# Altium schematic sheet Sheet1.SchDoc
size A2
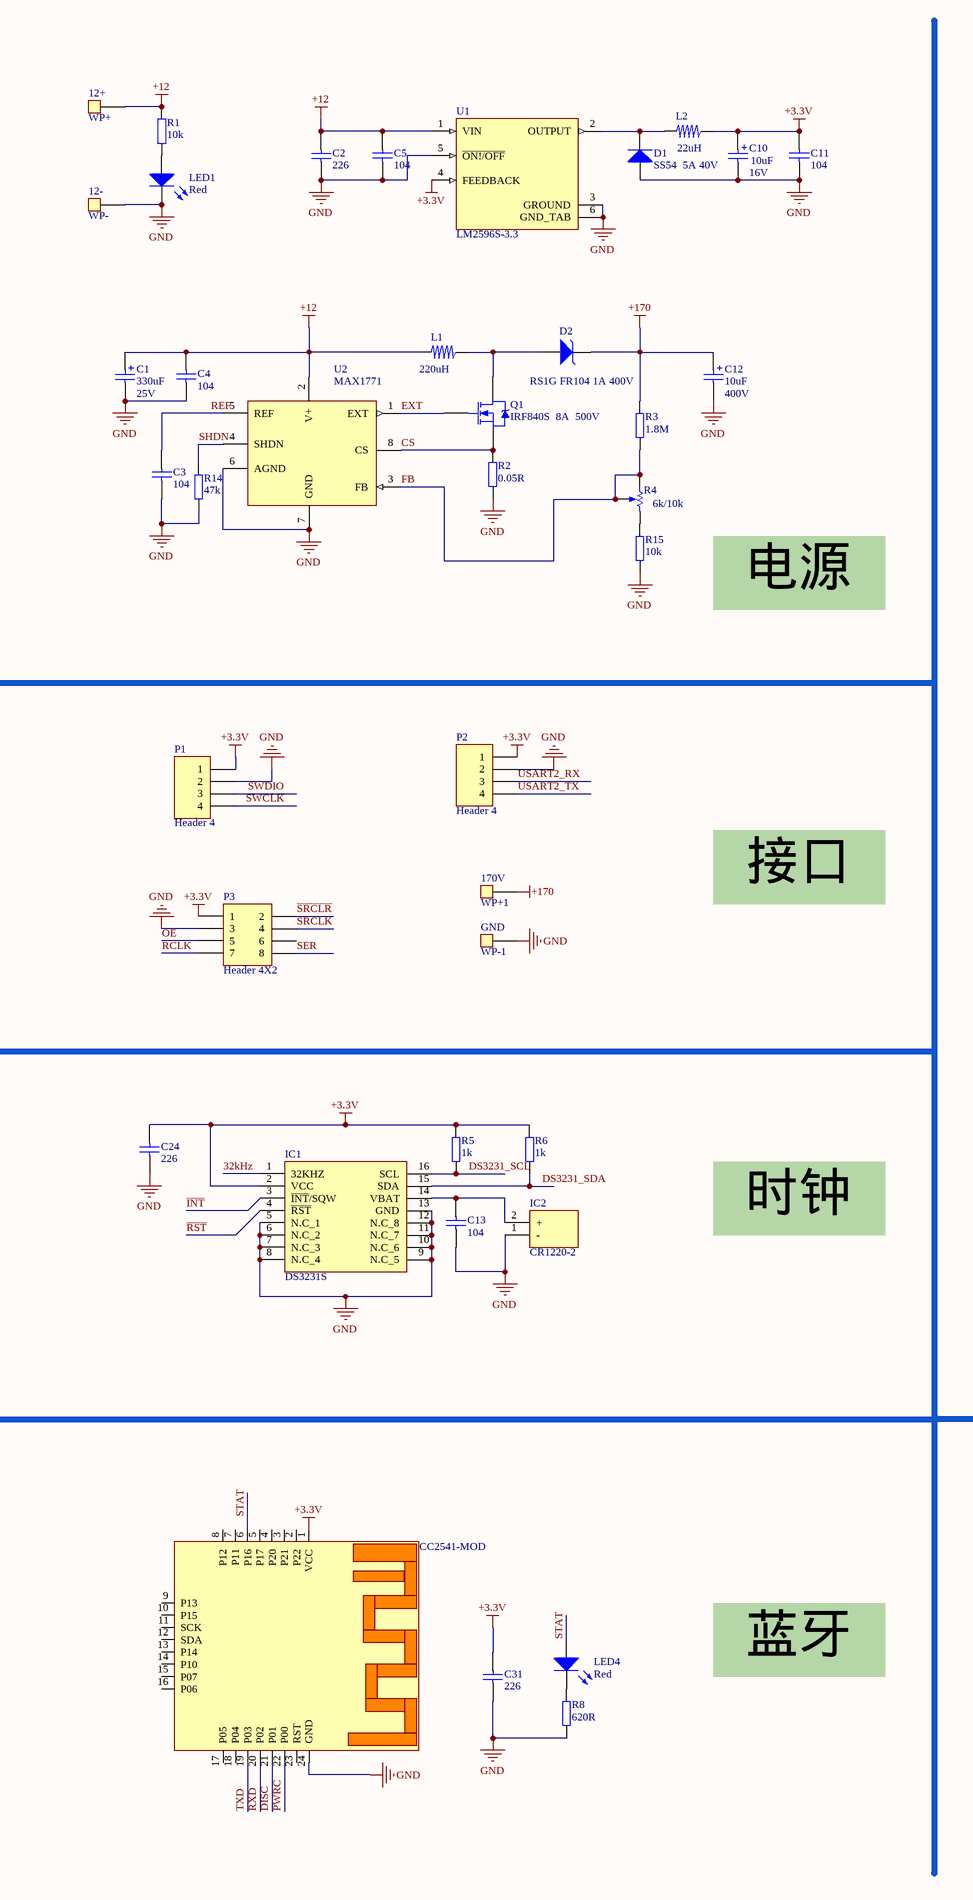
[diagram p0: Sheet1.SchDoc, left]
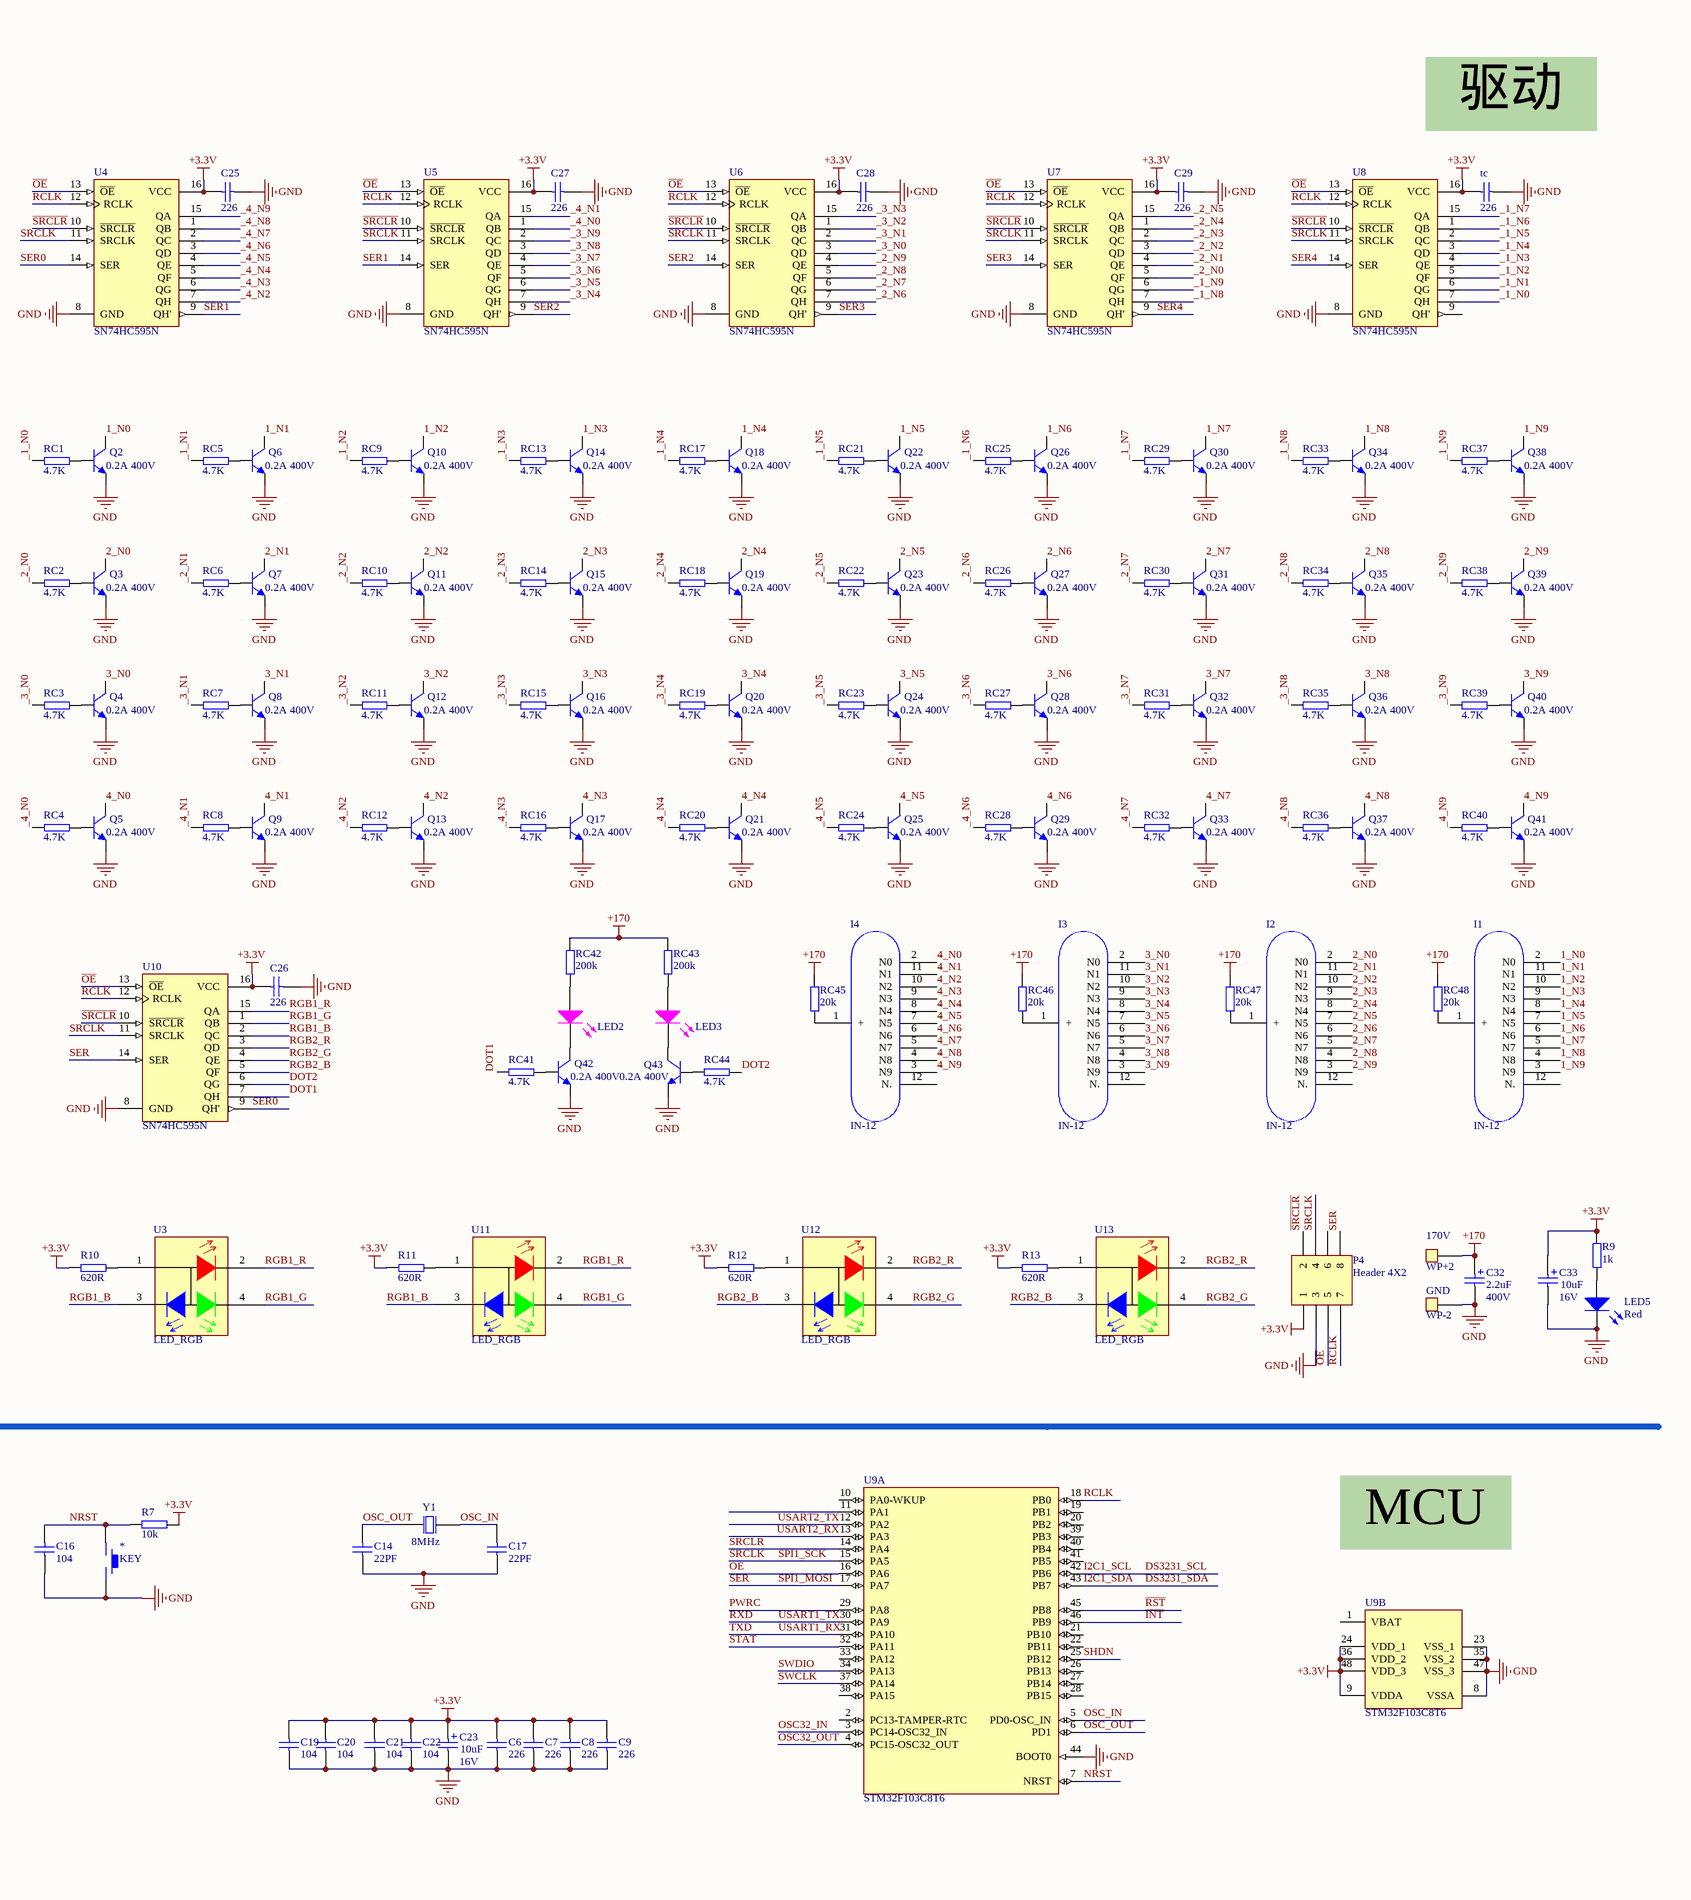
[diagram p1: Sheet1.SchDoc, right]

## Parts
*  KEY  [KEY]
?  CC2541-MOD  [JDY-08]
C1  Voltage: 25V  [CAPS8]  (hidden comment: 330uF)
C2  226  [CAPC1608[0603]]
C3  104  [CAPC1608[0603]]
C4  104  [CAPC1608[0603]]
C5  104  [CAPC1608[0603]]
C6  226  [CAPC1608[0603]]
C7  226  [CAPC1608[0603]]
C8  226  [CAPC1608[0603]]
C9  226  [CAPC1608[0603]]
C10  Voltage: 16V  [CAPS4]  (hidden comment: 10uF)
C11  104  [CAPC1608[0603]]
C12  Voltage: 400V  [CAPS10]  (hidden comment: 10uF)
C13  104  [CAPC1608[0603]]
C14  22PF  [CAPC1608[0603]]
C16  104  [CAPC1608[0603]]
C17  22PF  [CAPC1608[0603]]
C19  104  [CAPC1608[0603]]
C20  104  [CAPC1608[0603]]
C21  104  [CAPC1608[0603]]
C22  104  [CAPC1608[0603]]
C23  Voltage: 16V  [CAPS4]  (hidden comment: 10uF)
C24  226  [CAPC1608[0603]]
C25  226  [CAPC1608[0603]]
C26  226  [CAPC1608[0603]]
C27  226  [CAPC1608[0603]]
C28  226  [CAPC1608[0603]]
C29  226  [CAPC1608[0603]]
C31  226  [CAPC1608[0603]]
C32  Voltage: 400V  [CAPS6.3]  (hidden comment: 2.2uF)
C33  Voltage: 16V  [CAPS4]  (hidden comment: 10uF)
D1  SS54  5A 40V  [SMA[DO-214AC]]
D2  RS1G FR104 1A 400V  [SMA[DO-214AC]]
I1  IN-12  [Nixie_IN12-hole]
I2  IN-12  [Nixie_IN12-hole]
I3  IN-12  [Nixie_IN12-hole]
I4  IN-12  [Nixie_IN12-hole]
IC1  DS3231S  [SOIC127P1032X265-16N]
IC2  CR1220-2  [CR12202]
L1  220uH  [WHC1770]
L2  22uH  [WHC0630]
LED1  Red  [LEDC1608(0603)]
LED2  LED 5R  [LED-R5-H9-SINGLE-R]  (value not drawn)
LED3  LED 5R  [LED-R5-H9-SINGLE-R]  (value not drawn)
LED4  Red  [LEDC1608(0603)]
LED5  Red  [LEDC1608(0603)]
P1  Header 4  [HDR1X4]
P2  Header 4  [HDR1X4]
P3  Header 4X2  [HDR2X4]
P4  Header 4X2  [HDR2X4]
Q1  IRF840S  8A  500V  [TO-263]
Q2  0.2A 400V  [SOT23]
Q3  0.2A 400V  [SOT23]
Q4  0.2A 400V  [SOT23]
Q5  0.2A 400V  [SOT23]
Q6  0.2A 400V  [SOT23]
Q7  0.2A 400V  [SOT23]
Q8  0.2A 400V  [SOT23]
Q9  0.2A 400V  [SOT23]
Q10  0.2A 400V  [SOT23]
Q11  0.2A 400V  [SOT23]
Q12  0.2A 400V  [SOT23]
Q13  0.2A 400V  [SOT23]
Q14  0.2A 400V  [SOT23]
Q15  0.2A 400V  [SOT23]
Q16  0.2A 400V  [SOT23]
Q17  0.2A 400V  [SOT23]
Q18  0.2A 400V  [SOT23]
Q19  0.2A 400V  [SOT23]
Q20  0.2A 400V  [SOT23]
Q21  0.2A 400V  [SOT23]
Q22  0.2A 400V  [SOT23]
Q23  0.2A 400V  [SOT23]
Q24  0.2A 400V  [SOT23]
Q25  0.2A 400V  [SOT23]
Q26  0.2A 400V  [SOT23]
Q27  0.2A 400V  [SOT23]
Q28  0.2A 400V  [SOT23]
Q29  0.2A 400V  [SOT23]
Q30  0.2A 400V  [SOT23]
Q31  0.2A 400V  [SOT23]
Q32  0.2A 400V  [SOT23]
Q33  0.2A 400V  [SOT23]
Q34  0.2A 400V  [SOT23]
Q35  0.2A 400V  [SOT23]
Q36  0.2A 400V  [SOT23]
Q37  0.2A 400V  [SOT23]
Q38  0.2A 400V  [SOT23]
Q39  0.2A 400V  [SOT23]
Q40  0.2A 400V  [SOT23]
Q41  0.2A 400V  [SOT23]
Q42  0.2A 400V  [SOT23]
Q43  0.2A 400V  [SOT23]
R1  10k  [RESC1608[0603]]
R2  value 0.05R  [RESC3225[1210]]  (hidden comment: 0.05)
R3  1.8M  [RESC1608[0603]]
R4  6k/10k  [Rhostat3]
R5  1k  [RESC1608[0603]]
R6  1k  [RESC1608[0603]]
R7  10k  [RESC1608[0603]]
R8  620R  [RESC1608[0603]]
R9  1k  [RESC1608[0603]]
R10  620R  [RESC1608[0603]]
R11  620R  [RESC1608[0603]]
R12  620R  [RESC1608[0603]]
R13  620R  [RESC1608[0603]]
R14  47k  [RESC1608[0603]]
R15  10k  [RESC1608[0603]]
RC1  4.7K  [RESC1608[0603]]
RC2  4.7K  [RESC1608[0603]]
RC3  4.7K  [RESC1608[0603]]
RC4  4.7K  [RESC1608[0603]]
RC5  4.7K  [RESC1608[0603]]
RC6  4.7K  [RESC1608[0603]]
RC7  4.7K  [RESC1608[0603]]
RC8  4.7K  [RESC1608[0603]]
RC9  4.7K  [RESC1608[0603]]
RC10  4.7K  [RESC1608[0603]]
RC11  4.7K  [RESC1608[0603]]
RC12  4.7K  [RESC1608[0603]]
RC13  4.7K  [RESC1608[0603]]
RC14  4.7K  [RESC1608[0603]]
RC15  4.7K  [RESC1608[0603]]
RC16  4.7K  [RESC1608[0603]]
RC17  4.7K  [RESC1608[0603]]
RC18  4.7K  [RESC1608[0603]]
RC19  4.7K  [RESC1608[0603]]
RC20  4.7K  [RESC1608[0603]]
RC21  4.7K  [RESC1608[0603]]
RC22  4.7K  [RESC1608[0603]]
RC23  4.7K  [RESC1608[0603]]
RC24  4.7K  [RESC1608[0603]]
RC25  4.7K  [RESC1608[0603]]
RC26  4.7K  [RESC1608[0603]]
RC27  4.7K  [RESC1608[0603]]
RC28  4.7K  [RESC1608[0603]]
RC29  4.7K  [RESC1608[0603]]
RC30  4.7K  [RESC1608[0603]]
RC31  4.7K  [RESC1608[0603]]
RC32  4.7K  [RESC1608[0603]]
RC33  4.7K  [RESC1608[0603]]
RC34  4.7K  [RESC1608[0603]]
RC35  4.7K  [RESC1608[0603]]
RC36  4.7K  [RESC1608[0603]]
RC37  4.7K  [RESC1608[0603]]
RC38  4.7K  [RESC1608[0603]]
RC39  4.7K  [RESC1608[0603]]
RC40  4.7K  [RESC1608[0603]]
RC41  4.7K  [RESC1608[0603]]
RC42  200k  [RESC1608[0603]]
RC43  200k  [RESC1608[0603]]
RC44  4.7K  [RESC1608[0603]]
RC45  20k  [RESC1608[0603]]
RC46  20k  [RESC1608[0603]]
RC47  20k  [RESC1608[0603]]
RC48  20k  [RESC1608[0603]]
tc  226  [CAPC1608[0603]]
U1  LM2596S-3.3  [TO-263-5]
U2  MAX1771  [SOIC8]
U3  LED_RGB  [LED-RGB-0603]
U4  SN74HC595N  [SOIC16]
U5  SN74HC595N  [SOIC16]
U6  SN74HC595N  [SOIC16]
U7  SN74HC595N  [SOIC16]
U8  SN74HC595N  [SOIC16]
U9  STM32F103C8T6  [LQFP48_M]  (parts A,B of 2)
U10  SN74HC595N  [SOIC16]
U11  LED_RGB  [LED-RGB-0603]
U12  LED_RGB  [LED-RGB-0603]
U13  LED_RGB  [LED-RGB-0603]
WP+  12+  [WirePadSingleSide]  (no BOM)
WP+1  170V  [WirePadSingleSide]  (no BOM)
WP+2  170V  [WirePadSingleSide]  (no BOM)
WP-  12-  [WirePadSingleSide]  (no BOM)
WP-1  GND  [WirePadSingleSide]  (no BOM)
WP-2  GND  [WirePadSingleSide]  (no BOM)
Y1  8MHz  [XTAL-SMD]

## Nets
+3.3V: ?.1(VCC) C6.1 C7.1 C8.1 C9.1 C10.1 C11.2 C19.1 C20.1 C21.1 C22.1 C23.1 C24.1 C25.1 C26.1 C27.1 C28.1 C29.1 C31.1 C33.1 IC1.2(VCC) L2.1 P1.1 P2.1 P3.1 P4.1 R5.2 R6.2 R7.1 R9.2 R10.2 R11.2 R12.2 R13.2 tc.1 U1.4(FEEDBACK) U4.16(VCC) U5.16(VCC) U6.16(VCC) U7.16(VCC) U8.16(VCC) U9.9(VDDA) U9.24(VDD_1) U9.36(VDD_2) U9.48(VDD_3) U10.16(VCC)
+12: C1.1 C2.1 C4.2 C5.2 L1.2 R1.2 U1.1(VIN) U2.2(V+) WP+.1
+170: C12.1 C32.1 D2.K R3.2 RC42.2 RC43.2 RC45.2 RC46.2 RC47.2 RC48.1 WP+1.1 WP+2.1
GND: *.2 ?.24(GND) C1.2 C2.2 C3.1 C4.1 C5.1 C6.2 C7.2 C8.2 C9.2 C10.2 C11.1 C12.2 C13.2 C14.2 C16.2 C17.2 C19.2 C20.2 C21.2 C22.2 C23.2 C24.2 C25.2 C26.2 C27.2 C28.2 C29.2 C31.2 C32.2 C33.2 D1.A IC1.5(N.C_1) IC1.6(N.C_2) IC1.7(N.C_3) IC1.8(N.C_4) IC1.9(N.C_5) IC1.10(N.C_6) IC1.11(N.C_7) IC1.12(N.C_8) IC1.13(GND) IC2.1(-) LED1.C LED5.C P1.2 P2.2 P3.3 P4.3 Q2.2(E) Q3.2(E) Q4.2(E) Q5.2(E) Q6.2(E) Q7.2(E) Q8.2(E) Q9.2(E) Q10.2(E) Q11.2(E) Q12.2(E) Q13.2(E) Q14.2(E) Q15.2(E) Q16.2(E) Q17.2(E) Q18.2(E) Q19.2(E) Q20.2(E) Q21.2(E) Q22.2(E) Q23.2(E) Q24.2(E) Q25.2(E) Q26.2(E) Q27.2(E) Q28.2(E) Q29.2(E) Q30.2(E) Q31.2(E) Q32.2(E) Q33.2(E) Q34.2(E) Q35.2(E) Q36.2(E) Q37.2(E) Q38.2(E) Q39.2(E) Q40.2(E) Q41.2(E) Q42.2(E) Q43.2(E) R2.2 R8.1 R14.1 R15.1 tc.2 U1.3(GROUND) U1.5(~{ON!/OFF}) U1.6(GND_TAB) U2.6(AGND) U2.7(GND) U4.8(GND) U5.8(GND) U6.8(GND) U7.8(GND) U8.8(GND) U9.8(VSSA) U9.23(VSS_1) U9.35(VSS_2) U9.44(BOOT0) U9.47(VSS_3) U10.8(GND) WP-.1 WP-1.1 WP-2.1
1_N0: I1.2(N0) Q2.3(C)
1_N1: I1.11(N1) Q6.3(C)
1_N2: I1.10(N2) Q10.3(C)
1_N3: I1.9(N3) Q14.3(C)
1_N4: I1.8(N4) Q18.3(C)
1_N5: I1.7(N5) Q22.3(C)
1_N6: I1.6(N6) Q26.3(C)
1_N7: I1.5(N7) Q30.3(C)
1_N8: I1.4(N8) Q34.3(C)
1_N9: I1.3(N9) Q38.3(C)
2_N0: I2.2(N0) Q3.3(C)
2_N1: I2.11(N1) Q7.3(C)
2_N2: I2.10(N2) Q11.3(C)
2_N3: I2.9(N3) Q15.3(C)
2_N4: I2.8(N4) Q19.3(C)
2_N5: I2.7(N5) Q23.3(C)
2_N6: I2.6(N6) Q27.3(C)
2_N7: I2.5(N7) Q31.3(C)
2_N8: I2.4(N8) Q35.3(C)
2_N9: I2.3(N9) Q39.3(C)
3_N0: I3.2(N0) Q4.3(C)
3_N1: I3.11(N1) Q8.3(C)
3_N2: I3.10(N2) Q12.3(C)
3_N3: I3.9(N3) Q16.3(C)
3_N4: I3.8(N4) Q20.3(C)
3_N5: I3.7(N5) Q24.3(C)
3_N6: I3.6(N6) Q28.3(C)
3_N7: I3.5(N7) Q32.3(C)
3_N8: I3.4(N8) Q36.3(C)
3_N9: I3.3(N9) Q40.3(C)
4_N0: I4.2(N0) Q5.3(C)
4_N1: I4.11(N1) Q9.3(C)
4_N2: I4.10(N2) Q13.3(C)
4_N3: I4.9(N3) Q17.3(C)
4_N4: I4.8(N4) Q21.3(C)
4_N5: I4.7(N5) Q25.3(C)
4_N6: I4.6(N6) Q29.3(C)
4_N7: I4.5(N7) Q33.3(C)
4_N8: I4.4(N8) Q37.3(C)
4_N9: I4.3(N9) Q41.3(C)
32kHz: IC1.1(32KHZ)
_1_N0: RC1.1 U8.7(QH)
_1_N1: RC5.1 U8.6(QG)
_1_N2: RC9.1 U8.5(QF)
_1_N3: RC13.1 U8.4(QE)
_1_N4: RC17.1 U8.3(QD)
_1_N5: RC21.1 U8.2(QC)
_1_N6: RC25.1 U8.1(QB)
_1_N7: RC29.1 U8.15(QA)
_1_N8: RC33.1 U7.7(QH)
_1_N9: RC37.1 U7.6(QG)
_2_N0: RC2.1 U7.5(QF)
_2_N1: RC6.1 U7.4(QE)
_2_N2: RC10.1 U7.3(QD)
_2_N3: RC14.1 U7.2(QC)
_2_N4: RC18.1 U7.1(QB)
_2_N5: RC22.1 U7.15(QA)
_2_N6: RC26.1 U6.7(QH)
_2_N7: RC30.1 U6.6(QG)
_2_N8: RC34.1 U6.5(QF)
_2_N9: RC38.1 U6.4(QE)
_3_N0: RC3.1 U6.3(QD)
_3_N1: RC7.1 U6.2(QC)
_3_N2: RC11.1 U6.1(QB)
_3_N3: RC15.1 U6.15(QA)
_3_N4: RC19.1 U5.7(QH)
_3_N5: RC23.1 U5.6(QG)
_3_N6: RC27.1 U5.5(QF)
_3_N7: RC31.1 U5.4(QE)
_3_N8: RC35.1 U5.3(QD)
_3_N9: RC39.1 U5.2(QC)
_4_N0: RC4.1 U5.1(QB)
_4_N1: RC8.1 U5.15(QA)
_4_N2: RC12.1 U4.7(QH)
_4_N3: RC16.1 U4.6(QG)
_4_N4: RC20.1 U4.5(QF)
_4_N5: RC24.1 U4.4(QE)
_4_N6: RC28.1 U4.3(QD)
_4_N7: RC32.1 U4.2(QC)
_4_N8: RC36.1 U4.1(QB)
_4_N9: RC40.1 U4.15(QA)
CS: Q1.3(S) R2.1 U2.8(CS)
DISC: ?.21(P01)
DOT1: RC41.1 U10.7(QH)
DOT2: RC44.1 U10.6(QG)
DS3231_SCL: IC1.16(SCL) R5.1 U9.42(PB6)  [also labelled I2C1_SCL]
DS3231_SDA: IC1.15(SDA) R6.1 U9.43(PB7)  [also labelled I2C1_SDA]
EXT: Q1.1(G) U2.1(EXT)
FB: R3.1 R4.1(TOP) R4.3(TAP) U2.3(FB)
~{INT}: IC1.3(~{INT}/SQW) U9.46(PB9)
NRST: *.1 C16.1 R7.2 U9.7(NRST)
~{OE}: P3.5 P4.5 U4.13(~{OE}) U5.13(~{OE}) U6.13(~{OE}) U7.13(~{OE}) U8.13(~{OE}) U9.16(PA6) U10.13(~{OE})
OSC32_IN: U9.3(PC14-OSC32_IN)
OSC32_OUT: U9.4(PC15-OSC32_OUT)
OSC_IN: C17.1 U9.5(PD0-OSC_IN) Y1.2(OSC2)
OSC_OUT: C14.1 U9.6(PD1) Y1.1(OSC1)
PWRC: ?.22(P00) U9.29(PA8)
~{RST}: IC1.4(~{RST}) U9.45(PB8)
RCLK: P3.7 P4.7 U4.12(RCLK) U5.12(RCLK) U6.12(RCLK) U7.12(RCLK) U8.12(RCLK) U9.18(PB0) U10.12(RCLK)
REF: C3.2 U2.5(REF)
RGB1_B: U3.3 U10.2(QC) U11.3
RGB1_G: U3.4 U10.1(QB) U11.4
RGB1_R: U3.2 U10.15(QA) U11.2
RGB2_B: U10.5(QF) U12.3 U13.3
RGB2_G: U10.4(QE) U12.4 U13.4
RGB2_R: U10.3(QD) U12.2 U13.2
RXD: ?.20(P02) U9.30(PA9)  [also labelled USART1_TX]
~{SRCLR}: P3.2 P4.2 U4.10(~{SRCLR}) U5.10(~{SRCLR}) U6.10(~{SRCLR}) U7.10(~{SRCLR}) U8.10(~{SRCLR}) U9.14(PA4) U10.10(~{SRCLR})
SER: P3.8 P4.8 U9.17(PA7) U10.14(SER)  [also labelled SPI1_MOSI]
SER0: U4.14(SER) U10.9(QH')
SER1: U4.9(QH') U5.14(SER)
SER2: U5.9(QH') U6.14(SER)
SER3: U6.9(QH') U7.14(SER)
SER4: U7.9(QH') U8.14(SER)
SHDN: R14.2 U2.4(SHDN) U9.25(PB12)
SPI1_SCK: P3.4 P4.4 U4.11(SRCLK) U5.11(SRCLK) U6.11(SRCLK) U7.11(SRCLK) U8.11(SRCLK) U9.15(PA5) U10.11(SRCLK)  [also labelled SRCLK]
STAT: ?.6(P16) LED4.A U9.32(PA11)
SWCLK: P1.4 U9.37(PA14)
SWDIO: P1.3 U9.34(PA13)
TXD: ?.19(P03) U9.31(PA10)  [also labelled USART1_RX]
USART2_RX: P2.3 U9.13(PA3)
USART2_TX: P2.4 U9.12(PA2)
NetC13_1: C13.1 IC1.14(VBAT) IC2.2(+)
NetD1_K: D1.K L2.2 U1.2(OUTPUT)
NetD2_A: D2.A L1.1 Q1.2(D)
NetI1_1: I1.1(+) RC48.2
NetI2_1: I2.1(+) RC47.1
NetI3_1: I3.1(+) RC46.1
NetI4_1: I4.1(+) RC45.1
NetLED1_A: LED1.A R1.1
NetLED2_1: LED2.1(A) RC42.1
NetLED2_2: LED2.2(K) Q42.3(C)
NetLED3_1: LED3.1(A) RC43.1
NetLED3_2: LED3.2(K) Q43.3(C)
NetLED4_C: LED4.C R8.2
NetLED5_A: LED5.A R9.1
NetQ2_1: Q2.1(B) RC1.2
NetQ3_1: Q3.1(B) RC2.2
NetQ4_1: Q4.1(B) RC3.2
NetQ5_1: Q5.1(B) RC4.2
NetQ6_1: Q6.1(B) RC5.2
NetQ7_1: Q7.1(B) RC6.2
NetQ8_1: Q8.1(B) RC7.2
NetQ9_1: Q9.1(B) RC8.2
NetQ10_1: Q10.1(B) RC9.2
NetQ11_1: Q11.1(B) RC10.2
NetQ12_1: Q12.1(B) RC11.2
NetQ13_1: Q13.1(B) RC12.2
NetQ14_1: Q14.1(B) RC13.2
NetQ15_1: Q15.1(B) RC14.2
NetQ16_1: Q16.1(B) RC15.2
NetQ17_1: Q17.1(B) RC16.2
NetQ18_1: Q18.1(B) RC17.2
NetQ19_1: Q19.1(B) RC18.2
NetQ20_1: Q20.1(B) RC19.2
NetQ21_1: Q21.1(B) RC20.2
NetQ22_1: Q22.1(B) RC21.2
NetQ23_1: Q23.1(B) RC22.2
NetQ24_1: Q24.1(B) RC23.2
NetQ25_1: Q25.1(B) RC24.2
NetQ26_1: Q26.1(B) RC25.2
NetQ27_1: Q27.1(B) RC26.2
NetQ28_1: Q28.1(B) RC27.2
NetQ29_1: Q29.1(B) RC28.2
NetQ30_1: Q30.1(B) RC29.2
NetQ31_1: Q31.1(B) RC30.2
NetQ32_1: Q32.1(B) RC31.2
NetQ33_1: Q33.1(B) RC32.2
NetQ34_1: Q34.1(B) RC33.2
NetQ35_1: Q35.1(B) RC34.2
NetQ36_1: Q36.1(B) RC35.2
NetQ37_1: Q37.1(B) RC36.2
NetQ38_1: Q38.1(B) RC37.2
NetQ39_1: Q39.1(B) RC38.2
NetQ40_1: Q40.1(B) RC39.2
NetQ41_1: Q41.1(B) RC40.2
NetQ42_1: Q42.1(B) RC41.2
NetQ43_1: Q43.1(B) RC44.2
NetR4_2: R4.2(BOT) R15.2
NetR10_1: R10.1 U3.1
NetR11_1: R11.1 U11.1
NetR12_1: R12.1 U12.1
NetR13_1: R13.1 U13.1

Not connected (* = marked no-connect by the designer): ? 2(P22) 3(P21) 4(P20) 5(P17) 7(P11) 8(P12) 9(P13) 10(P15) 11(SCK) 12(SDA) 13(P14) 14(P10) 15(P07) 16(P06) 17(P05) 18(P04) 23(RST); I1 12(N.); I2 12(N.); I3 12(N.); I4 12(N.); P3 6; P4 6; U8 9(QH'); U9 1(VBAT) 2(PC13-TAMPER-RTC) 10(PA0-WKUP) 11(PA1) 19(PB1) 20(PB2) 21(PB10) 22(PB11) 26(PB13) 27(PB14) 28(PB15) 33(PA12) 38(PA15) 39(PB3) 40(PB4) 41(PB5)

## Notes on the sheet
- 驱动
- 电源
- 接口
- 时钟
- MCU
- 蓝牙

## Library data of the parts
C1 C10 C12 C23 C32 C33 = Cap Solid: Polarized Capacitor (Radial); Published: 8-Jun-2000; Revision: July-2002: Re-released for DXP Platform.; Publisher: Altium Limited; Price(RMB): 0.000
  C1: Value: 330uF
  C10 C12 C23 C33: Value: 10uF
  C32: Value: 2.2uF
C2-C9 C11 C13 C14 C16 C17 C19-C22 C24-C29 C31 tc = Cap Chip 1: Chip Capacitor, PSpice Model; Tolerance: Y5V; Voltage: 3V; Published: 8-Jun-2000; Revision: July-2002: Re-released for DXP Platform.; Publisher: Altium Limited; Price(RMB): 0.000
  C2 C6-C9 C24-C29 C31 tc: Value: 226
  C3-C5 C11 C13 C16 C19-C22: Value: 104
  C14 C17: Value: 22PF
D1 = Diode SMx: Molded Diode; Imax: 500mA; Voltage: 5A40V; Published: 8-Jun-2000; Revision: July-2002: Re-released for DXP Platform.; Publisher: Altium Limited; Price(RMB): 0.000; PartNumber: SS54  5A 40V
D2 = Diode TVS Uni-Dir: TRANSIENT VOLTAGE  SUPPRESSOR DIODE; PartNumber: P/N; Imax: 500mA; Voltage: 1A 400V; Published: 8-Jun-2000; Publisher: Altium Limited; Price(RMB): 0.000
I1-I4 = IN12
IC1 = DS3231S: Integrated Circuit; Manufacturer_Name: Maxim Integrated; Datasheet Link: http://componentsearchengine.com/Datasheets/1/DS3231S.pdf; Height: 2.65mm; Manufacturer_Part_Number: DS3231S; Mouser Part Number: 700-DS3231S-; Mouser Price/Stock: https://www.mouser.co.uk/ProductDetail/Maxim-Integrated/DS3231S/?qs=ffX8NcjNb2RJWdvttxi1fQ%3D%3D
IC2 = CR1220-2: Integrated Circuit; Manufacturer_Name: Q&J; Datasheet Link: https://datasheet.lcsc.com/szlcsc/Q-J-CR1220-2_C70381.pdf; Height: 4.1mm; Manufacturer_Part_Number: CR1220-2
L1 L2 = L
  L1: Value: 220uH
  L2: Value: 22uH
LED1 LED4 LED5 = LED Chip: Typical Chip LED; Published: 8-Jun-2000; Revision: July-2002: Re-released for DXP Platform.; Publisher: Altium Limited; Price(RMB): 0.00; Color: Red
LED2 LED3 = LED 5R: Red, 5mm, Typical INFRARED GaAs LED; Published: 8-Jun-2000; Revision: July-2002: Re-released for DXP Platform.; Publisher: Altium Limited; Price(RMB): 0.00
P1 P2 = Header 4: Header, 4-Pin; LatestRevisionDate: 17-Jul-2002; LatestRevisionNote: Re-released for DXP Platform.; Publisher: Altium Limited; Price(RMB): 0.00
P3 P4 = Header 4X2: Header, 4-Pin, Dual row; LatestRevisionDate: 17-Jul-2002; LatestRevisionNote: Re-released for DXP Platform.; Publisher: Altium Limited; Price(RMB): 0.00
Q1 = NMOS
Q2-Q43 = NPN SMC SOT-23: NPN Bipolar Transistor; Published: 8-Jun-2000; Revision: July-2002: Re-released for DXP Platform.; Publisher: Altium Limited; Price(RMB): 0.000; PartNumber: 0.2A 400V
R1-R3 R5-R15 RC1-RC48 = Res Chip 2p 1: Chip Resistor, PSpice Model, IPC PCB Library Drawing; Tolerance: 5%; TC1: 0; Published: 8-Jun-2000; Revision: July-2002: Re-released for DXP Platform.; Publisher: Altium Limited; Price(RMB): 0.000; TC2: 0
  R1 R7 R15: Value: 10k
  R3: Value: 1.8M
  R5 R6 R9: Value: 1k
  R8 R10-R13: Value: 620R
  R14: Value: 47k
  RC1-RC41 RC44: Value: 4.7K
  RC42 RC43: Value: 200k
  RC45-RC48: Value: 20k
R4 = Rhostat: Value: 6k/10k
U1 = LM2596S-5.0: SIMPLE SWITCHER&reg; 4.5V to 40V, 3A Low Component Count Step-Down Regulator 5-DDPAK/TO-263; MF: Texas Instruments; MP: LM2596S-5.0/NOPB; DigiKey-Purchase-URL: https://snapeda.com/shop?store=DigiKey&id=15588; Mouser-Purchase-URL: https://snapeda.com/shop?store=Mouser&id=15588; SnapEDA_Link: https://www.snapeda.com/parts/LM2596S-5.0/NOPB/Texas%20Instruments/view-part/15588/?ref=snap; Price: None; Value: *; Availability: Good; Texas_Instruments-Purchase-URL: https://snapeda.com/shop?store=Texas+Instruments&id=15588; Package: TO-263-5 Texas Instruments; Check_prices: https://www.snapeda.com/parts/LM2596S-5.0/NOPB/Texas%20Instruments/view-part/15588/?ref=eda
U2 = MAX1771: DC-to-DC Converter Control Circuit; Price(RMB): 0.0; PartNumber: MAX1771
U4-U8 U10 = SN74HC595N: 8-Bit Shift Register with 3-State Output Registers; Published: 8-Jun-2000; LatestRevisionDate: 04-Mar-2005; LatestRevisionNote: Stylized 3D Model Added.; DatasheetVersion: May-1997; PackageVersion: Oct-1995; PackageReference: N016; Publisher: Altium Limited; PackageDescription: DIP; 16 Leads; Row Spacing 7.62 mm; Pitch 2.54 mm; Code_JEDEC: MS-001-BB; ComponentLink1Description: Manufacturer Link; ComponentLink1URL: http://www.ti.com/; ComponentLink2Description: Datasheet; ComponentLink2URL: http://www-s.ti.com/sc/ds/sn74hc595.pdf; Price(RMB): 0.00
U9 = STM32F103C8T6: STM32 ARM-based 32-bit MCU Performance Line with 64 kB Flash, 20 kB Internal RAM, -40 to +85癈 Temperature, 48-Pin LQFP, Tray; DatasheetVersion: rev13.0, Apr-2011; PackageVersion: rev13, Apr-2011; PackageReference: LQFP48; PackageDescription: 48-Pin Low-Profile Quad Flat Pack, 7 x 7 mm Body, 0.5 mm Pitch (LQFP48); ComponentLink1Description: Manufacturer URL; ComponentLink1URL: http://www.st.com/; ComponentLink2Description: STM32F103 Datasheet; ComponentLink2URL: http://www.st.com/internet/com/TECHNICAL_RESOURCES/TECHNICAL_LITERATURE/DATASHEET/CD00161566.pdf; ComponentLink3Description: STM32 Family Web Page; ComponentLink3URL: www.st.com/stm32
WP+ WP+1 WP+2 WP- WP-1 WP-2 = Wire Pad: Wire soldering pad.; Price(RMB): 0.000
Y1 = XTAL: Crystal Oscillator; Published: 8-Jun-2000; Revision: July-2002: Re-released for DXP Platform.; Publisher: Altium Limited; Value: 8MHz; Price(RMB): 0.000